# EAGLE schematic programmer (EAGLE 9.6.2)
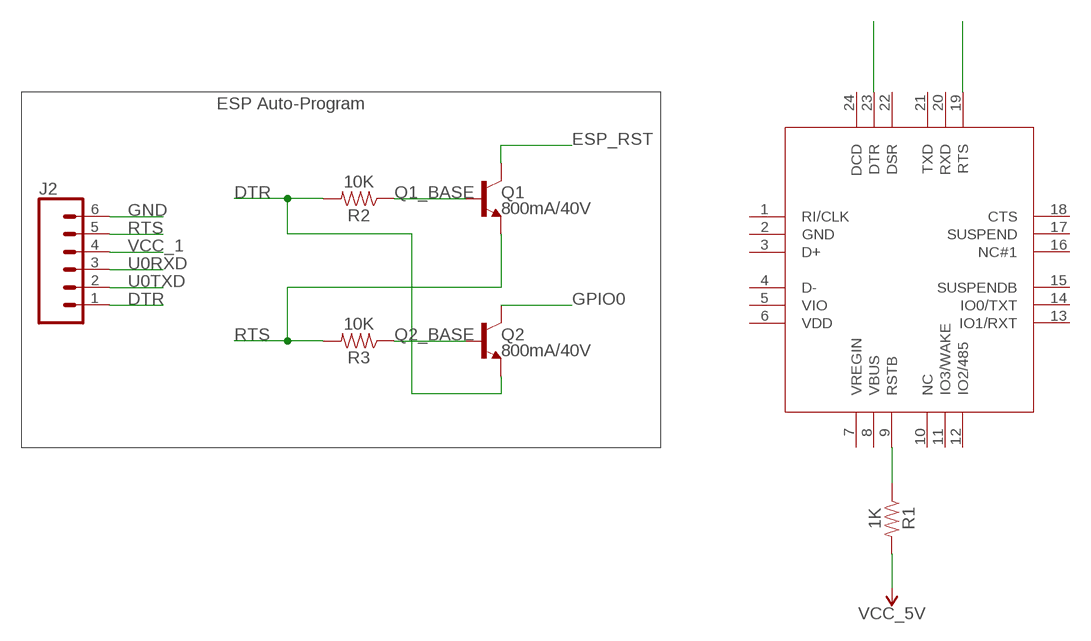
[diagram p0: schematic, sheet 1]

## Parts
J2  CONN_06SILK_FEMALE_PTH  [1X06]
Q1  800mA/40V  TRANS_NPN-MMBT2222AL  [SOT23-3]
Q2  800mA/40V  TRANS_NPN-MMBT2222AL  [SOT23-3]
R1  1K  RESISTOR  [0805]
R2  10K  RESISTOR  [0805]
R3  10K  RESISTOR  [0805]
U$1  CP2102  [CP2102_QFN24]

## Nets
DTR: J2.1 Q2.2(E) R2.2
ESP_RST: Q1.3(C)
GND: J2.6
GPIO0: Q2.3(C)
N$1: R1.1 U$1.9(RSTB)
N$2: U$1.19(RTS)
N$3: U$1.23(DTR)
Q1_BASE: Q1.1(B) R2.1
Q2_BASE: Q2.1(B) R3.1
RTS: J2.5 Q1.2(E) R3.2
U0RXD: J2.3
U0TXD: J2.2
VCC_1: J2.4 R1.2 ; supply symbol labelled VCC_5V
Unconnected: U$1.1(RI/CLK) U$1.2(GND) U$1.3(D+) U$1.4(D-) U$1.5(VIO) U$1.6(VDD) U$1.7(VREGIN) U$1.8(VBUS) U$1.10(NC) U$1.11(IO3/WAKE) U$1.12(IO2/485) U$1.13(IO1/RXT) U$1.14(IO0/TXT) U$1.15(SUSPENDB) U$1.16(NC#1) U$1.17(SUSPEND) U$1.18(CTS) U$1.20(RXD) U$1.21(TXD) U$1.22(DSR) U$1.24(DCD)

## Notes on the sheet
- ESP Auto-Program

## Library data of the parts
J2 = SparkFun-Connectors:CONN_06: Multi connection point. Often used as Generic Header-pin footprint for 0.1 inch spaced/style header connections On any of the 0.1 inch spaced packages, you can populate with these: Break Away Headers - Straight <https://www.sparkfun.com/products/116> (PRT-00116) Break Away Male Headers - Right Angle <https://www.sparkfun.com/products/553> (PRT-00553) Female Headers <https://www.sparkfun.com/products/115> (PRT-00115) Break Away Headers - Machine Pin <https://www.sparkfun.com/products/117> (PRT-00117) Break Away Female Headers - Swiss Machine Pin <https://www.sparkfun.com/products/743> (PRT-00743) Arduino Stackable Header - 6 Pin <https://www.sparkfun.com/products/9280> (PRT-09280) For SCREWTERMINALS and SPRING TERMINALS visit here: Screw Terimnals on SparkFun.com <https://www.sparkfun.com/search/results?term=Screw+Terminals> (5mm/3.5mm/2.54mm spacing) This device is also useful as a general connection point to wire up your design to another part of your project. Our various solder wires solder well into these plated through hole pads. Hook-Up Wire - Assortment (Stranded, 22 AWG) <https://www.sparkfun.com/products/11375> (PRT-11375) Hook-Up Wire - Assortment (Solid Core, 22 AWG) <https://www.sparkfun.com/products/11367> (PRT-11367) View the entire wire category on our website here <https://www.sparkfun.com/categories/141>; PROD_ID: CONN-08437
Q1 Q2 = SparkFun-DiscreteSemi:TRANS_NPN: NPN transistor Current controlled devices typically used to amplify current or used as a switch. BC547 - COM-08928 <http://www.sparkfun.com/products/8928> (TO-92 45V 100mA) (1.Collector 2.Base 3.Emitter) 2N3904 - COM-00521 <http://www.sparkfun.com/products/521> (TO-92 40V 200mA) (1.Emitter 2.Base 3.Collector) P2N2222A - COM-12852 <http://www.sparkfun.com/products/12852> (TO-92 40V 600mA) (1.Collector 2.Base 3.Emitter); PROD_ID: TRANS-08049; VALUE: 600mA/40V
R1-R3 = _111_IH:RESISTOR
U$1 = infinity_mirror_revd:CP2102